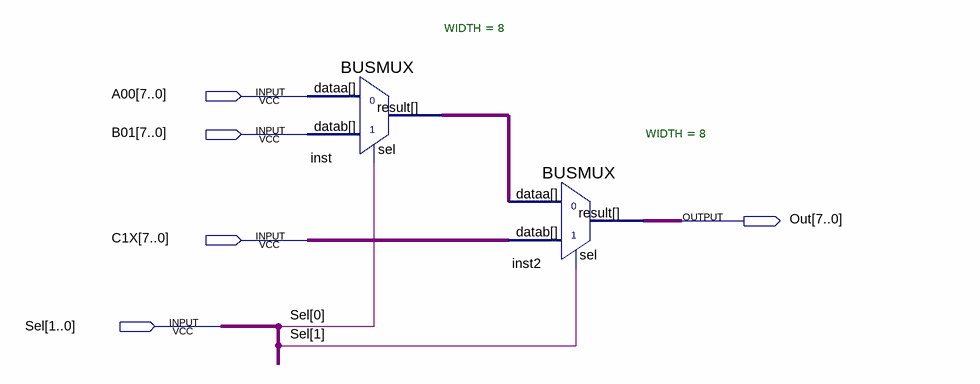
[diagram p0: schematic sheet]
// Quartus schematic Mux_3to1_8bit.bdf as structural Verilog: 2 symbols, 5 pins
module Mux_3to1_8bit (
  input  [7:0] A00,
  input  [7:0] B01,
  input  [7:0] C1X,
  input  [1:0] Sel,
  output [7:0] Out
);

  wire [7:0] inst_result;

  BUSMUX #(.WIDTH(8)) inst (.datab(B01), .sel(Sel[0]), .dataa(A00), .result(inst_result));
  BUSMUX #(.WIDTH(8)) inst2 (.datab(C1X), .sel(Sel[1]), .dataa(inst_result), .result(Out));
endmodule
